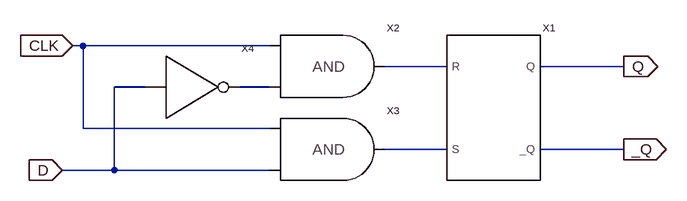
[diagram p0: schematic Dlatch.asc]
Dlatch.asc, the LTspice schematic file:
Version 4
SHEET 1 880 680
WIRE -256 96 -272 96
WIRE 32 96 -256 96
WIRE 304 128 208 128
WIRE 576 128 448 128
WIRE -160 160 -208 160
WIRE 32 160 -16 160
WIRE -256 224 -256 96
WIRE 32 224 -256 224
WIRE 304 256 208 256
WIRE 576 256 448 256
WIRE -208 288 -208 160
WIRE -208 288 -288 288
WIRE 32 288 -208 288
FLAG -272 96 CLK
IOPIN -272 96 In
FLAG -288 288 D
IOPIN -288 288 In
FLAG 576 128 Q
IOPIN 576 128 Out
FLAG 576 256 _Q
IOPIN 576 256 Out
SYMBOL SRlatch 384 192 R0
SYMATTR InstName X1
SYMBOL AND_2 48 128 R0
SYMATTR InstName X2
SYMBOL AND_2 48 256 R0
SYMATTR InstName X3
SYMBOL inverter -128 160 R0
SYMATTR InstName X4

The netlist it stands for:
* Dlatch.asc
XX1 N001 N003 _Q Q SRlatch  ; pins R S _Q Q
XX2 CLK N002 N001 AND_2  ; pins Vin1 Vin2 Vout
XX3 CLK D N003 AND_2  ; pins Vin1 Vin2 Vout
XX4 D N002 inverter  ; pins Vin Vout
.backanno
.end